# Altium schematic sheet FTDI.SchDoc: Shipwars FTDI Schematic
size 431 x 279 mm; CheckedBy: SP, PS; Author: SP, PS; CompanyName: UPenn; DrawnBy: SP, PS; Engineer: SP, PS; Organization: UPenn; Address1: 200 S 33rd Street; Address2: Detkin Lab; Address3: Philadelphia; Address4: PA 19104; Revision: .1.0.0; SheetNumber: 4; SheetTotal: 10; Project: Shipwars
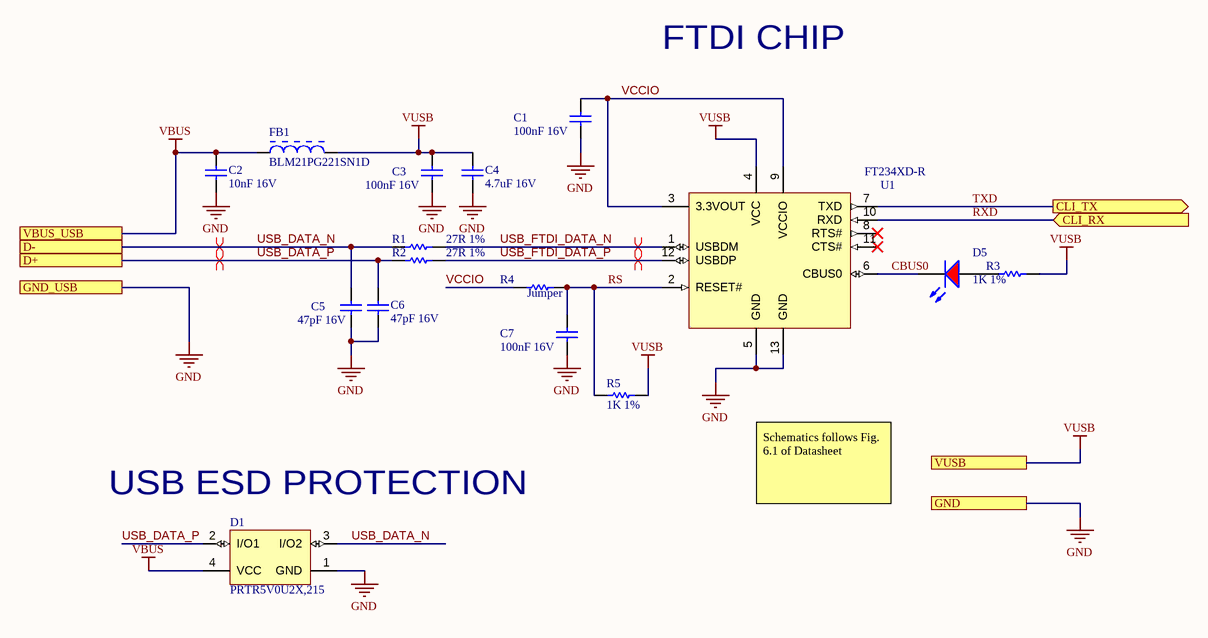
[diagram p0: FTDI.SchDoc]

## Parts
C1  100nF 16V  [CAPC0603(1608)100_N]
C2  10nF 16V  [CAPC0603(1608)100_N]
C3  100nF 16V  [CAPC0603(1608)100_N]
C4  4.7uF 16V  [CAPC0805(2012)145_N]
C5  47pF 16V  [CAPC0603(1608)100_N]
C6  47pF 16V  [CAPC0603(1608)100_N]
C7  100nF 16V  [CAPC0603(1608)100_N]
D1  PRTR5V0U2X,215  [NXP-SOT143B-4_V]
D5  LTST-C170CKT  [LTST-C170CKT_V]  (value not drawn)
FB1  BLM21PG221SN1D  [MURA-BLM21-B20-CHIP-2_V2]
R1  27R 1%  [RESC0603(1608)_N]
R2  27R 1%  [RESC0603(1608)_N]
R3  1K 1%  [RESC0603(1608)_N]
R4  Jumper  [RESC0603(1608)_N]
R5  1K 1%  [RESC0603(1608)_N]
U1  FT234XD-R  [DFN-12_V]

## Ports
CLI_RX (in), CLI_TX (out), D+, D-, GND, GND_USB, VBUS_USB, VUSB

## Nets
GND: C1.1 C2.1 C3.1 C4.1 C5.1 C6.1 C7.1 D1.1(GND) U1.5(GND) U1.13(GND) ; port GND, port GND_USB
VBUS: C2.2 D1.4(VCC) FB1.1 ; port VBUS_USB
VUSB: C3.2 C4.2 FB1.2 R3.2 R5.1 U1.4(VCC) ; port VUSB
CBUS0: D5.2(K) U1.6(CBUS0)
RS: C7.2 R4.2 R5.2 U1.2(RESET#)
RXD: U1.10(RXD) ; port CLI_RX
TXD: U1.7(TXD) ; port CLI_TX
USB_DATA_N: C5.2 D1.3(I/O2) R1.1 ; port D-
USB_DATA_P: C6.2 D1.2(I/O1) R2.1 ; port D+
USB_FTDI_DATA_N: R1.2 U1.1(USBDM)
USB_FTDI_DATA_P: R2.2 U1.12(USBDP)
VCCIO: C1.2 R4.1 U1.3(3.3VOUT) U1.9(VCCIO)
NetD5_1: D5.1(A) R3.1

Not connected (* = marked no-connect by the designer): U1 8(RTS#)* 11(CTS#)*

## Layout directives
differential pair: USB_DATA_N, USB_DATA_P, USB_FTDI_DATA_N, USB_FTDI_DATA_P

## Notes on the sheet
- FTDI CHIP
- (near D1) USB ESD PROTECTION
- Schematics follows Fig. 6.1 of Datasheet
- DWG. NO.
- REV.
- SHT.
- THIS DOCUMENT AND THE DATA DISCLOSED HEREIN OR HEREWITH IS THE PROPERTY OF ALTIUM LIMITED AND MAY BE FREELY DISTRIBUTED IN WHOLE. NO RIGHTS ARE RESERVED OR EXPRESS OR IMPLIED WARANTEE GIVEN.
- REVISION
- DESCRIPTION
- DATE
- APPROVED
- ENG:
- APPROVALS
- PROJECT
- DSN:
- CHK:
- REFERENCE DOCUMENTS
- PROJECT REVISION:
- TITLE
- DOCUMENT REVISION:
- DESIGN ITEM:
- BOM:
- FAB DWG:
- PCB DWG:
- ASSY DWG:
- SCALE:
- SIZE
- B
- CAGE CODE
- FILE NAME
- DWG NO.
- SHEET
- OF
- REV

## Library data of the parts
C1 C3 C7 = CMP-1035-02584-1: CAP 100nF 16V ±10% 0603 (1608 Metric) Thickness 1mm SMD; Tolerance: Â±10%; Case-EIA: 0603; Case-Metric: 1608; Technology: SMT; Max Thickness: 1 mm; Value: 100nF; Rated Voltage: 16 V
C2 = CMP-1035-02311-1: CAP 10nF 16V ±10% 0603 (1608 Metric) Thickness 1mm SMD; Case-EIA: 0603; Case-Metric: 1608; Tolerance: Â±10%; Rated Voltage: 16 V; Value: 10nF; Max Thickness: 1 mm; Technology: SMT
C4 = CMP-1036-04893-1: CAP 4.7uF 16V -20% to +80% 0805 (2012 Metric) Thickness 1.45mm SMD; Case-Metric: 2012; Case-EIA: 0805; Max Thickness: 1.45 mm; Value: 4.7uF; Rated Voltage: 16 V; Tolerance: -20% to +80%; Technology: SMT
C5 C6 = CMP-1035-01048-1: CAP 47pF 16V ±0.5pF 0603 (1608 Metric) Thickness 1mm SMD; Case-EIA: 0603; Case-Metric: 1608; Tolerance: Â±0.5pF; Technology: SMT; Value: 47pF; Rated Voltage: 16 V; Max Thickness: 1 mm
D1 = CMP-2000-05285-1: Ultra Low Capacitance Double Rail-to-Rail ESD Protection Diode, 5.5 V, 1 pF, -40 to 85 degC, 4-Pin SOT143B, RoHS, Tape and Reel; Manufacturer: NXP Semiconductors; Capacitance Value: 16pF; Number of Elements: 1; Rad Hardened: No; Reverse Breakdown Voltage: 6V; Working Voltage (Max): 5.5V; Polarity: Uni-Directional; Configuration: Quad; Leakage Current: 0.1uA; Product Height (mm): 1mm; Suppressor Type: DiodeArrays; Product Length (mm): 3mm; Product Depth (mm): 1.4mm; ESD Protection Voltage: 8KV@ContactDisc; Package Type: SOT; Mounting: SurfaceMount; Packaging: TapeandReel; Datasheet Version: Rev. 02, 01/2008; Reverse Stand-off Voltage: 5.5V; Manufacturer URL: http://www.nxp.com/; Operating Temp Range: -40Cto85C; Operating Temperature Classification: Industrial; Working Voltage: 5.5V; Operating Temperature Min Deg. C: -40C; Datasheet URL: https://datasheet.ciiva.com/4479/prtr5v0u2x-102853-4479461.pdf; Leakage Current (Max): 0.1uA; Direction Type: Uni-Directional; Pin Count: 3+Tab; Operating Temperature Max Deg. C: 85C; Mounting Style: SurfaceMount; Package / Case: SOT
D5 = CMP-1674-00001-5: LED Uni-Color Red, 100 mW, 200 mA, -55 to 85 degC, 2-Pin SMD, RoHS, Tape and Reel; Manufacturer: Lite-On; PackageReference: C170CKT; ComponentLink1Description: Manufacturer URL; ComponentLink1URL: http://www.us.liteon.com/; Package Quantity: 3000; Packaging: Tape and Reel; Pins: 2; ComponentLink2URL: http://media.digikey.com/pdf/Data%20Sheets/Lite-On%20PDFs/LTST-C170CKT.pdf; Max Operating Temperature: 85 degC; Min Operating Temperature: -55 degC; Mounting Technology: Surface Mount; Mount: Surface Mount; Length: 2 mm; ComponentLink2Description: Datasheet; DatasheetVersion: 03/2003; Height: 1.1 mm; PackageDescription: 2-Pin Surface Mount Device, Body 2 x 1.25 mm; RoHSCompliant: true; Colour: Red
FB1 = CMP-0686-00610-2: Chip Ferrite Bead for Power Lines, 220 Ohm, 2000 mA, -55 to 125 degC, 2 x 1.25 x 1.05 mm SMD, Tape and Reel; Manufacturer: Murata; DC Resistance: 0.045 Ohm Max.; Impedance (at 100 MHz): 220 Ohm +/- 25%; Rated Current: 2000 mA; PartNumber: BLM21PG221SN1D; Mounting Technology: Surface Mount; DatasheetVersion: 08/2013; ComponentLink3URL: http://www.murata.com/products/catalog/pdf/c31e.pdf; ComponentLink1URL: http://www.murata.com/; ComponentLink1Description: Manufacturer URL; ComponentLink2URL: http://www.murata.com/products/catalog/pdf/c31e.pdf; PackageDescription: 2-Pin Chip, Body 2 x 1.25 mm; ComponentLink3Description: Package Specification; Operating Temperature Range: -55 to 125 degC; Packing: Tape and Reel; ComponentLink2Description: Datasheet; PackageReference: BLM21_H1050-2
R1 R2 = CMP-1012-00331-1: 27R 0.1W 1% 0603 (1608 Metric)  SMD; Case-EIA: 0603; Value: 27.00 Ohm; Case-Metric: 1608; Technology: SMT; Tolerance: 1 %; Power: 0.1 W
R3 R5 = CMP-1012-00510-1: 1K 0.1W 1% 0603 (1608 Metric)  SMD; Case-Metric: 1608; Case-EIA: 0603; Value: 1000.00 Ohm; Technology: SMT; Tolerance: 1 %; Power: 0.1 W
R4 = CMP-1012-00001-1: Jumper 0603 (1608 Metric); Case-Metric: 1608; Value: 0.00 Ohm; Power: None; Case-EIA: 0603; Technology: SMT; Tolerance: None
U1 = CMP-0248-00027-1: FT234XD USB to BASIC UART IC, -40 to +85 degC, 12-Pin DFN, Pb-Free, Tape and Reel; Manufacturer: FTDI; PackageReference: DFN-12; PackageVersion: Feb-13; DatasheetVersion: ver 1.1, Feb-2013; ComponentLink1URL: http://www.ftdichip.com/; PartNumber: FT234XD-R; ComponentLink2URL: http://www.ftdichip.com/Support/Documents/DataSheets/ICs/DS_FT234XD.pdf; ComponentLink1Description: Manufacturer URL; PackageDescription: 12-Pin Dual Flat No-Lead, 3 x 3 mm Body, 0.45 mm Pitch, Exposed Pad; ComponentLink2Description: Datasheet